# Altium schematic sheet LED_Tutorial_2.SchDoc
size A; SheetNumber: 1; SheetTotal: 1
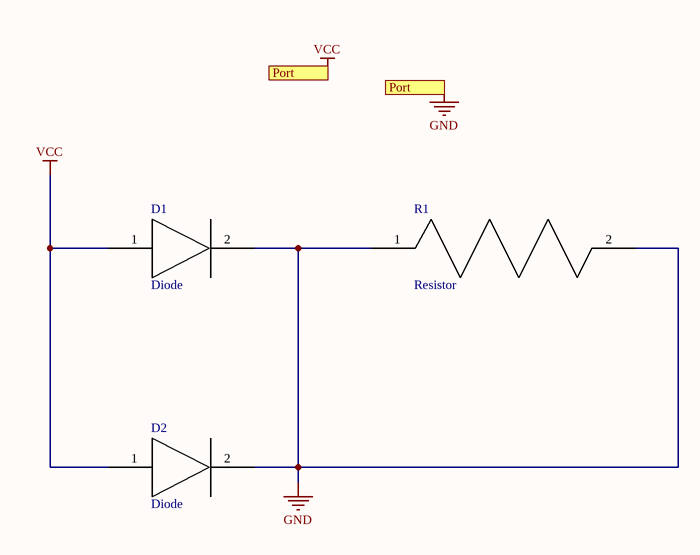
[diagram p0: LED_Tutorial_2.SchDoc]

## Parts
D1  Diode
D2  Diode
R1  Resistor

## Ports
Port

## Nets
GND: D1.1 D1.2 D2.1 D2.2 R1.1 R1.2 ; port Port  [also labelled VCC]